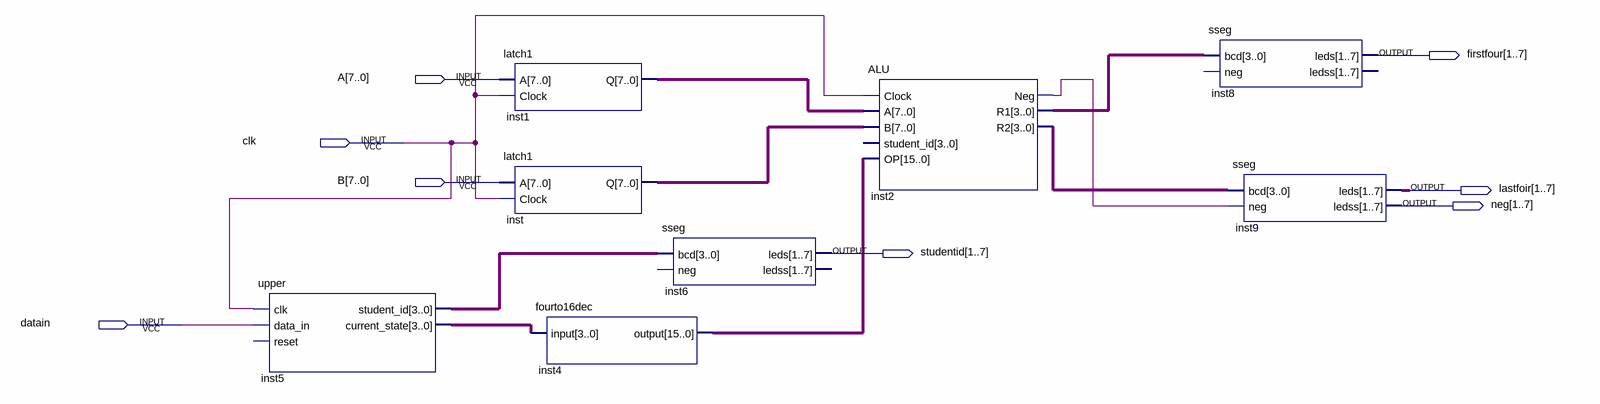
[diagram p0: schematic sheet]
// Quartus schematic fianlbdf.bdf as structural Verilog: 8 symbols, 8 pins
module fianlbdf (
  input  [7:0] A,
  input  clk,
  input  [7:0] B,
  input  datain,
  output [1:7] firstfour,
  output [1:7] lastfoir,
  output [1:7] neg,
  output [1:7] studentid
);

  wire inst2_neg;
  wire [3:0] inst2_r1, inst2_r2, inst5_current_state, inst5_student_id;
  wire [7:0] inst1_q, inst_q;
  wire [15:0] inst4_output;

  upper inst5 (
    .clk(clk), .data_in(datain), .student_id(inst5_student_id), .current_state(inst5_current_state));  // open: reset
  latch1 inst1 (.A(A), .Clock(clk), .Q(inst1_q));
  latch1 inst (.A(B), .Clock(clk), .Q(inst_q));
  fourto16dec inst4 (.\input (inst5_current_state), .\output (inst4_output));
  sseg inst6 (.bcd(inst5_student_id), .leds(studentid));  // open: neg, ledss
  ALU inst2 (
    .Clock(clk), .A(inst1_q), .B(inst_q), .OP(inst4_output), .Neg(inst2_neg), .R1(inst2_r1), .R2(inst2_r2));  // open: student_id
  sseg inst8 (.bcd(inst2_r1), .leds(firstfour));  // open: neg, ledss
  sseg inst9 (.bcd(inst2_r2), .neg(inst2_neg), .leds(lastfoir), .ledss(neg));
endmodule
